# Altium schematic sheet USB_OTG_FS.SchDoc: USB OTG FS
size A4; CompanyName: STMicroelectronics; Organization: Microcontrollers Division; DocumentNumber: 15; SheetNumber: 7; SheetTotal: 19
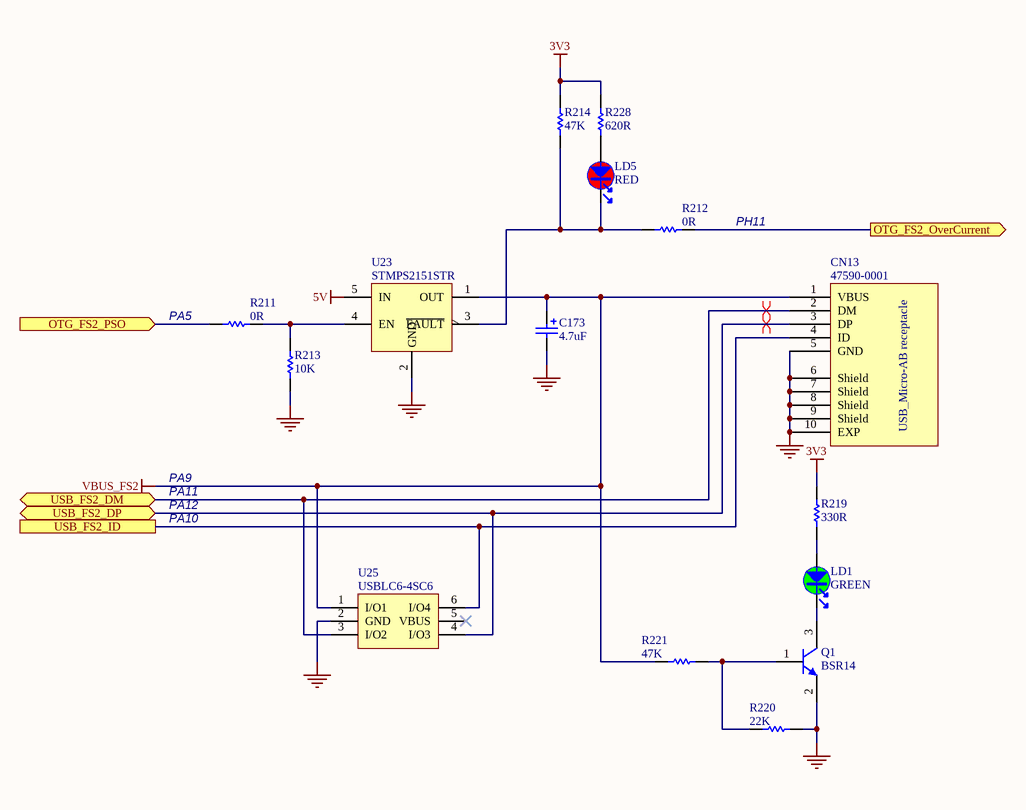
[diagram p0: USB_OTG_FS.SchDoc]

## Parts
C173  value 4.7uF  [CPOL_VISHAY_TANTAL-595D_1407_H220]  (hidden comment: Cap_POL_TANA)
CN13  Manufacturer_Part_Number: 47590-0001  [CON_USBMICROAB_MOLEX_47590-0001_H3]  (hidden comment: USB_uAB_47590.0001)
LD1  value GREEN  [LED_0603_GREEN]  (hidden comment: LED_green)
LD5  value RED  [LED_0603_RED]  (hidden comment: LED_red)
Q1  value BSR14  [NPN_SOT23]  (hidden comment: 9013-SOT23)
R211  value 0R  [R0402]  (hidden comment: Resistor)
R212  value 0R  [R0402]  (hidden comment: Resistor)
R213  value 10K  [R0402]  (hidden comment: Resistor)
R214  value 47K  [R0402]  (hidden comment: Resistor)
R219  value 330R  [R0402]  (hidden comment: Resistor)
R220  value 22K  [R0402]  (hidden comment: Resistor)
R221  value 47K  [R0402]  (hidden comment: Resistor)
R228  value 620R  [R0402]  (hidden comment: Resistor)
U23  STMPS2151STR  [MOS_SOT23-5L]
U25  USBLC6-4SC6  [ESD_SOT23-6L]

## Ports
OTG_FS2_OverCurrent (out), OTG_FS2_PSO (in), USB_FS2_DM (bidir), USB_FS2_DP (bidir), USB_FS2_ID

## Nets
3V3: R214.2 R219.2 R228.2
5V: U23.5(IN)
GND: C173.2 CN13.5(GND) CN13.6(Shield) CN13.7(Shield) CN13.8(Shield) CN13.9(Shield) CN13.10(EXP) Q1.2(E) R213.1 R220.2 U23.2(GND) U25.2(GND)
VBUS_FS2: C173.1 CN13.1(VBUS) R221.2 U23.1(OUT) U25.1(I/O1)
OTG_FS2_OverCurrent: R212.2 ; port OTG_FS2_OverCurrent
OTG_FS2_PSO: R211.1 ; port OTG_FS2_PSO
USB_FS2_DM: CN13.2(DM) U25.3(I/O2) ; port USB_FS2_DM
USB_FS2_DP: CN13.3(DP) U25.4(I/O3) ; port USB_FS2_DP
USB_FS2_ID: CN13.4(ID) U25.6(I/O4) ; port USB_FS2_ID
NetLD1_1: LD1.1 R219.1
NetLD1_2: LD1.2 Q1.3(C)
NetLD5_1: LD5.1 R228.1
NetLD5_2: LD5.2 R212.1 R214.1 U23.3(~{FAULT})
NetQ1_1: Q1.1(B) R220.1 R221.1
NetR211_2: R211.2 R213.2 U23.4(EN)

Not connected (* = marked no-connect by the designer): U25 5(VBUS)*

## Layout directives
differential pair: USB_FS2_DM, USB_FS2_DP

## Notes on the sheet
- PH11
- (near R211) PA5
- PA9
- PA10
- PA11
- PA12
- Title:
- Project:
- Size:
- Revision:
- Variant:
- A4
- -
- Date:
- Reference:
- Sheet:
- of
- (in symbol MCD-00022) USB_Micro-AB receptacle

## Library data of the parts
C173 = MCD-00595: Capacitor, Tantalum, 4.7uF, 16V, +/-10%, 595D case A; Manufacturer_Part_Number: 595D475X9016A2T; Manufacturer: VISHAY; Part_Preference: Recommended; Order_Code_RS: 117-303; Provided_By: Subcon; Initial_Board_Reference: MB1331; Component_Country_Of_Origin: Israel; ID: 3146; ShowFields: YES; Revision: July-2002: Re-released for DXP Platform.; Internal_Part_Number: MCD-00595; Status: Released; Part_Type: Capacitor; ComponentLink1Description: VISHAY_CAPACITOR_TANTALUM_595D.pdf; ComponentLink1URL: http://tunmcdsvn.tun.st.com/Component_Documentation_Library/Trunk/Capacitor/VISHAY_595D_Series; Order_Code_Digikey: 595D475X9016A2T-ND; Order_Code_Farnell: 1166805; Package: 3718 (metric)
CN13 = MCD-00022: USB-MICRO-AB, 0.65mm, RA, SMT, Top Mount (compatible with MCD-00661 USB certified); Part_Type: Connector; Manufacturer: MOLEX; Alternate_Manufacturer_Part_Number: ZX62D-AB-5P8(30); Alternate_Manufacturer: HIROSE; Part_Preference: Recommended; Provided_By: Subcon; Initial_Board_Reference: MB1274; Component_Country_Of_Origin: Unknown; ID: 2495; Order_Code_RS: 1568022; ShowFields: YES; Internal_Part_Number: MCD-00022; Value: USB_uAB_47590.0001; Status: Released; ComponentLink1Description: Molex_Connector-USB-microAB_47590-0001.pdf; ComponentLink1URL: http://tunmcdsvn.tun.st.com/Component_Documentation_Library/Trunk/Connector/MOLEX_47590-0001/; ECCN_US: n/a; ECCN_EU: n/a; Order_Code_Digikey: WM17144TR-ND; Order_Code_Farnell: 1568022
LD1 = MCD-02900: LED, Green, 2V, 25mA, 0603, SMD; Part_Type: Display; Part_Preference: Recommended; Manufacturer: EVERLIGHT; Manufacturer_Part_Number: 19-213SYGC/S530-E2/5T; Full_Alternate_Internal_Part_Number: MCD-00320; Partial_Alternate_Internal_Part_Number: MCD-00050; Component_Country_Of_Origin: China; ShowFields: YES; ID: 5016; Internal_Part_Number: MCD-02900; Status: Checked; Package: 0603; ComponentLink1URL: http://tunmcdsvn.tun.st.com/Component_Documentation_Library/Trunk/Display/EVERLIGHT_19-213SYGC-S530-E2-5T; Order_Code_Digikey: 1080-19-213SYGC/S530-E2/5TTR-ND; Order_Code_Farnell: N/A; Order_Code_RS: N/A
LD5 = MCD-02899: LED, Red, VF : Min=1.75V , Max=2.35V, 25mA, 0603; Part_Type: Display; Part_Preference: Recommended; Manufacturer: EVERLIGHT; Manufacturer_Part_Number: 19-213/R6C-AP1Q2B/5T; Full_Alternate_Internal_Part_Number: MCD-00049; Component_Country_Of_Origin: China; ShowFields: YES; ID: 5015; Internal_Part_Number: MCD-02899; Status: Checked; Package: 0603; ComponentLink1URL: http://tunmcdsvn.tun.st.com/Component_Documentation_Library/Trunk/Display/EVERLIGHT_19-213-R6C-AP1Q2B-5T; Order_Code_Digikey: 1080-19-213/R6C-AP1Q2B/5TTR-ND; Order_Code_Farnell: N/A; Order_Code_RS: N/A
Q1 = MCD-00073: NPN Bipolar Transistor; Manufacturer: ON SEMICONDUCTOR; Part_Preference: Recommended; Partial_Alternate_Internal_Part_Number: MCD-01737, MCD-03305, , MCD-02988; ECCN_US: EAR99; ECCN_EU: NEC; Provided_By: Subcon; Initial_Board_Reference: MB1274; Component_Country_Of_Origin: Unknown; ID: 2519; ShowFields: YES; Revision: *; Internal_Part_Number: MCD-00073; Status: Released; Part_Type: Transistor; Manufacturer_Part_Number: BSR14; ComponentLink1Description: NXP_Transistor_BSR14.pdf; ComponentLink1URL: http://tunmcdsvn.tun.st.com/Component_Documentation_Library/Trunk/IC/ON_SEMICONDUCTOR_BSR14; Order_Code_Digikey: N/A; Order_Code_Farnell: N/A; Order_Code_RS: N/A; Package: SOT23
R211 R212 = MCD-00052: Resistor,0R,0402,5%,1/16W; Manufacturer_Part_Number: RC0402JR-070RL; Manufacturer: YAGEO; Part_Preference: Recommended; Provided_By: Subcon; Initial_Board_Reference: MB1274; Component_Country_Of_Origin: China; ID: 2540; Order_Code_RS: 9232516RL; ShowFields: YES; Internal_Part_Number: MCD-00052; Status: Released; Part_Type: Resistor; Package: 0402; ComponentLink1Description: Yageo_Resistor_RC0402-series.pdf; ComponentLink1URL: http://tunmcdsvn.tun.st.com/Component_Documentation_Library/Trunk/Resistor/YAGEO_RC_L_Series; ECCN_US: n/a; ECCN_EU: n/a; Order_Code_Digikey: 311-0.0JRCT-ND; Order_Code_Farnell: 9232516RL
R213 = MCD-00053: Resistor,10K,0402,1%,1/16W; Manufacturer_Part_Number: RC0402FR-0710KL; Manufacturer: YAGEO; BMS_Part_Number: 9131590; Part_Preference: Recommended; Provided_By: subcon; Initial_Board_Reference: MB1274; Component_Country_Of_Origin: China; ID: 2539; Order_Code_RS: 9239359; ShowFields: YES; Internal_Part_Number: MCD-00053; Status: Released; Part_Type: Resistor; Package: 0402; ComponentLink1Description: Yageo_Resistor_RC0402-series.pdf; ComponentLink1URL: http://tunmcdsvn.tun.st.com/Component_Documentation_Library/Trunk/Resistor/YAGEO_RC_L_Series; ECCN_US: n/a; ECCN_EU: n/a; Order_Code_Digikey: 311-10.0KLRCT-ND; Order_Code_Farnell: 9239359
R214 R221 = MCD-00063: Resistor,47K,0402,1%,1/16W; Manufacturer_Part_Number: RC0402FR-0747KL; Manufacturer: YAGEO; Part_Preference: Recommended; Provided_By: Subcon; Initial_Board_Reference: MB1274; Component_Country_Of_Origin: China; ID: 2528; Order_Code_RS: 9239430; ShowFields: YES; Internal_Part_Number: MCD-00063; Status: Released; Part_Type: Resistor; Package: 0402; ComponentLink1Description: Yageo_Resistor_RC0402-series.pdf; ComponentLink1URL: http://tunmcdsvn.tun.st.com/Component_Documentation_Library/Trunk/Resistor/YAGEO_RC_L_Series; ECCN_US: n/a; ECCN_EU: n/a; Order_Code_Digikey: 311-47.0KLRCT-ND; Order_Code_Farnell: 9239430
R219 = MCD-00062: Resistor,330R,0402,1%,1/16W; Manufacturer_Part_Number: RC0402FR-07330RL; Manufacturer: YAGEO; Part_Preference: Recommended; Provided_By: Subcon; Initial_Board_Reference: MB1274; Component_Country_Of_Origin: China; ID: 2529; Order_Code_RS: 9239170; ShowFields: YES; Internal_Part_Number: MCD-00062; Status: Released; Part_Type: Resistor; Package: 0402; ComponentLink1Description: Yageo_Resistor_RC0402-series.pdf; ComponentLink1URL: http://tunmcdsvn.tun.st.com/Component_Documentation_Library/Trunk/Resistor/YAGEO_RC_L_Series; ECCN_US: n/a; ECCN_EU: n/a; Order_Code_Digikey: 311-330LRCT-ND; Order_Code_Farnell: 9239170
R220 = MCD-00429: Resistor,22K,0402,1%,1/16W; Manufacturer_Part_Number: RC0402FR-0722KL; Manufacturer: YAGEO; Part_Preference: Recommended; Provided_By: Subcon; Component_Country_Of_Origin: China; ID: 2849; ShowFields: YES; Internal_Part_Number: MCD-00429; Status: Released; Part_Type: Resistor; Package: 0402; ComponentLink1Description: Yageo_Resistor_RC0402-series.pdf; ComponentLink1URL: http://tunmcdsvn.tun.st.com/Component_Documentation_Library/Trunk/Resistor/YAGEO_RC_L_Series; ECCN_US: n/a; ECCN_EU: n/a; Order_Code_Digikey: 311-22.0KLRCT-ND; Order_Code_Farnell: 9239391; Order_Code_RS: N/A
R228 = MCD-00499: Resistor,620R,0402,1%,1/16W; Manufacturer_Part_Number: RC0402FR-07620RL; Manufacturer: YAGEO; Part_Preference: Recommended; Provided_By: Subcon; Component_Country_Of_Origin: China; ID: 2781; ShowFields: YES; Internal_Part_Number: MCD-00499; Status: Released; Part_Type: Resistor; Package: 0402; ComponentLink1Description: Yageo_Resistor_RC0402-series.pdf; ComponentLink1URL: http://tunmcdsvn.tun.st.com/Component_Documentation_Library/Trunk/Resistor/YAGEO_RC_L_Series; ECCN_US: n/a; ECCN_EU: n/a; Order_Code_Digikey: 311-620LRCT-ND; Order_Code_Farnell: 1458815; Order_Code_RS: N/A
U23 = MCD-00159: 500mA, Enhanced single channel power switches with active high enable pin; Part_Type: IC; Manufacturer: STMICROELECTRONICS; BMS_Part_Number: 9159009; Part_Preference: Recommended; ECCN_US: EAR99; ECCN_EU: NEC; Provided_By: Subcon; Initial_Board_Reference: MB1264; Component_Country_Of_Origin: Malaysia; ID: 2708; Order_Code_RS: 165-5516; ShowFields: YES; Internal_Part_Number: MCD-00159; Value: STMPS2151STR; Status: Released; Manufacturer_Part_Number: STMPS2151STR; ComponentLink1Description: STM_PWR-Switch_STMPS2151STR.pdf; ComponentLink1URL: http://tunmcdsvn.tun.st.com/Component_Documentation_Library/Trunk/IC/STMICROELECTRONICS_STMPS2151STR; Order_Code_Digikey: 497-6934-2-ND; Order_Code_Farnell: 1842616; Package: SOT23-5
U25 = MCD-00250: Very low capacitance ESD protection , 4 lines; Part_Type: Diode; Manufacturer: STMICROELECTRONICS; BMS_Part_Number: 9151001; Manufacturer_HQ_COO: EU; Part_Preference: Recommended; ECCN_US: EAR99; ECCN_EU: NEC; Provided_By: Subcon; Initial_Board_Reference: MB1311; Component_Country_Of_Origin: China; ID: 2616; Order_Code_RS: 920-6272; ShowFields: YES; Internal_Part_Number: MCD-00250; Value: USBLC6-4SC6; Status: Released; Manufacturer_Part_Number: USBLC6-4SC6; ComponentLink1Description: ST_USBLC6-4SC6.pdf; ComponentLink1URL: http://tunmcdsvn.tun.st.com/Component_Documentation_Library/Trunk/IC/STMICROELECTRONICS_USBLC6-4SC6; Order_Code_Digikey: 497-4492-2-ND; Order_Code_Farnell: 2473978; Package: SOT23-6